# EAGLE schematic Schematico-amplificatore-audio (EAGLE 9.7.0)
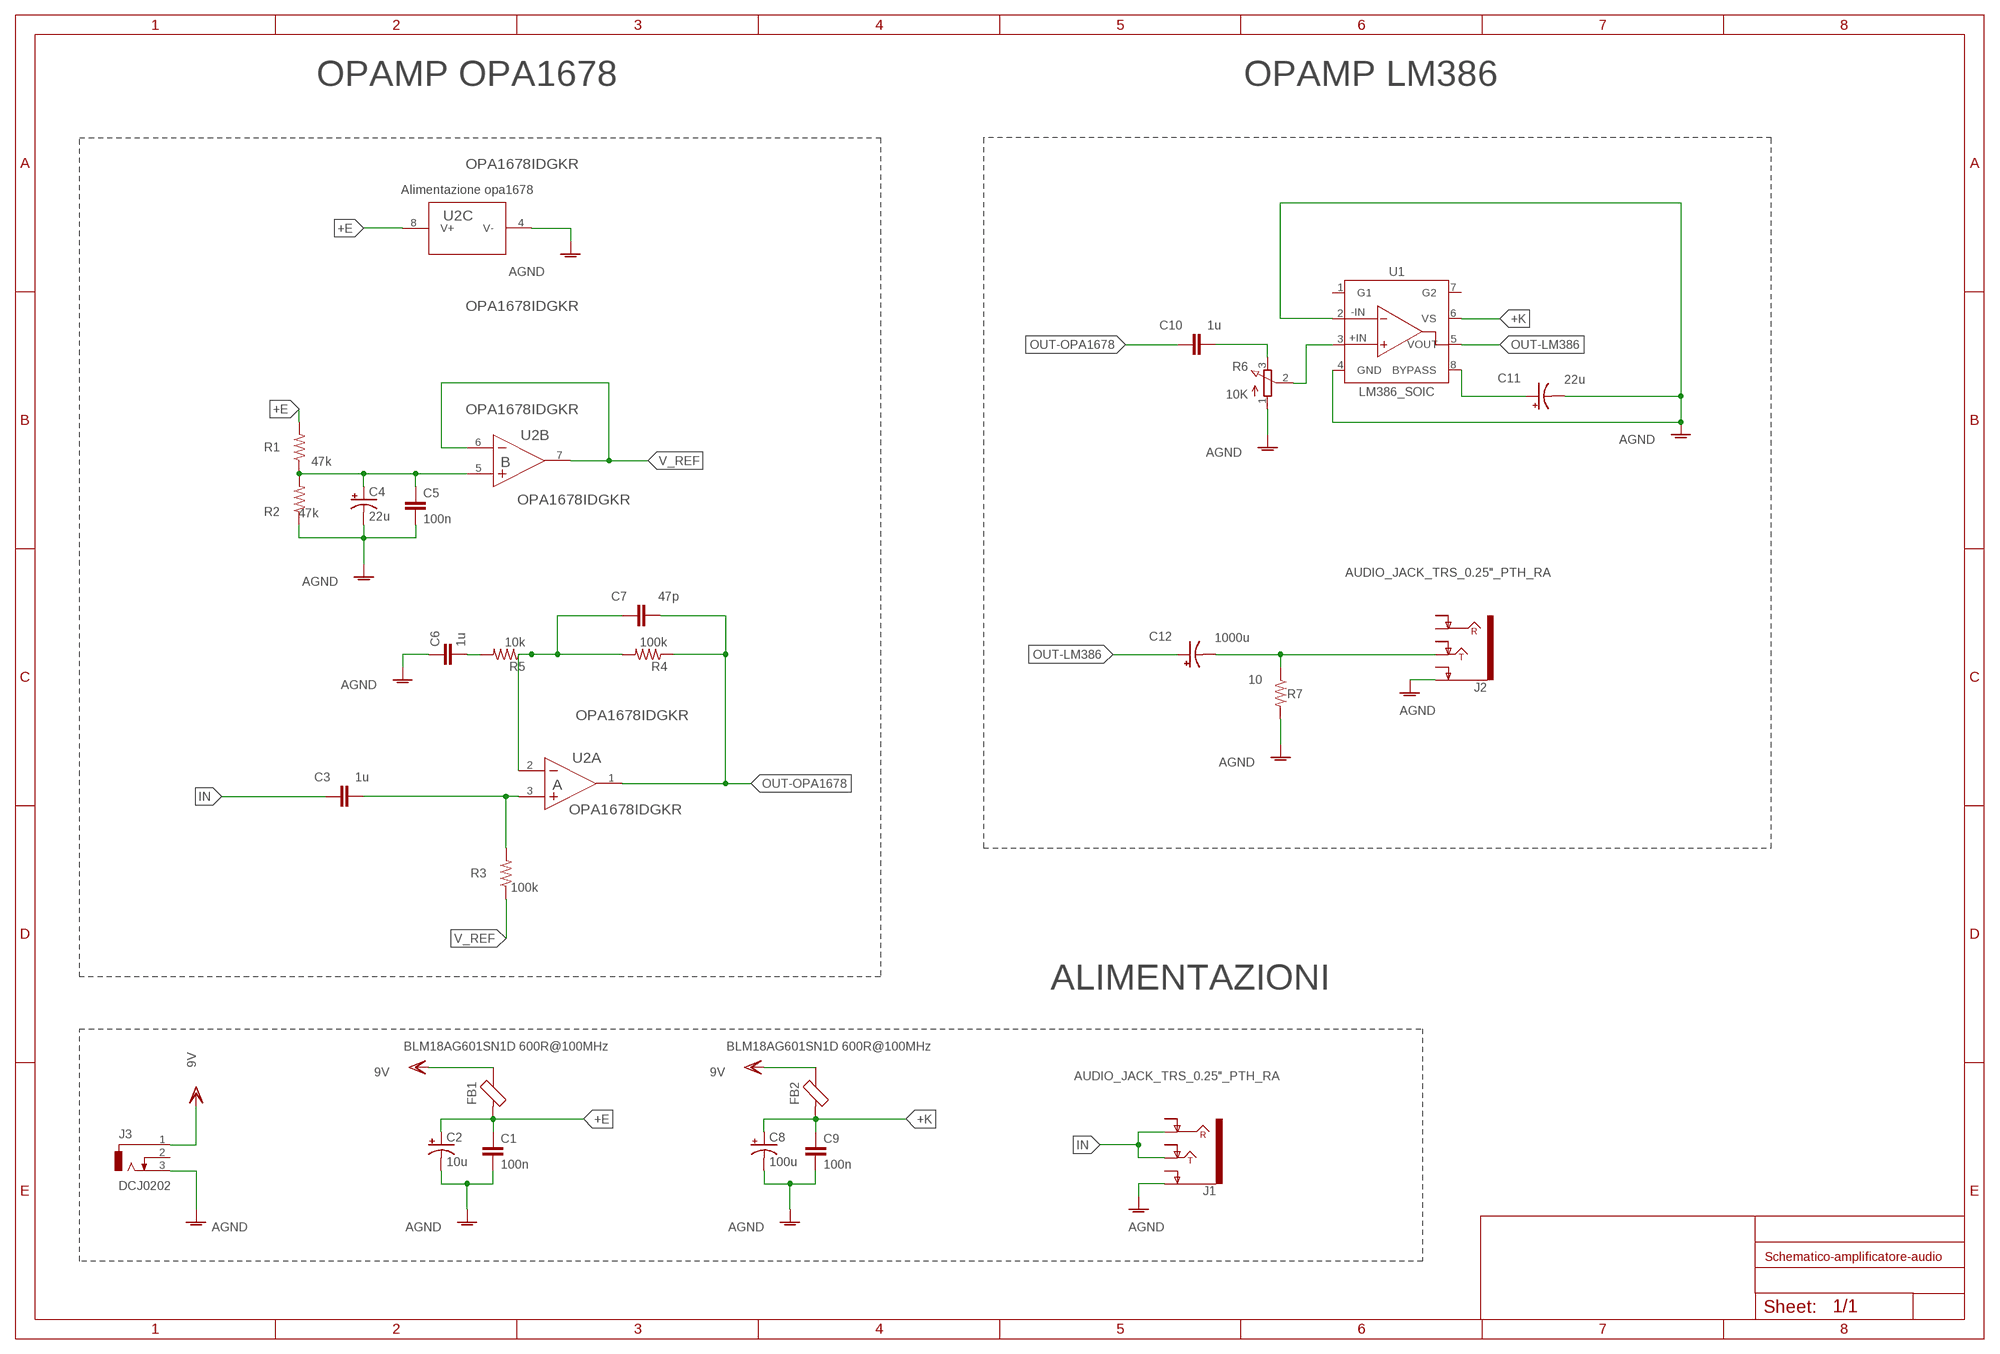
[diagram p0: schematic, sheet 1]

## Parts
C1  100n  C-EUC0603  [C0603]
C2  10u  CPOL-USCT3216  [CT3216]
C3  1u  C-EUC0603  [C0603]
C4  22u  CPOL-USCT3216  [CT3216]
C5  100n  C-EUC0603  [C0603]
C6  1u  C-EUC0603  [C0603]
C7  47p  C-EUC0603  [C0603]
C8  100u  CPOL-USCT3216  [CT3216]
C9  100n  C-EUC0603  [C0603]
C10  1u  C-EUC0603  [C0603]
C11  22u  CPOL-USCT3216  [CT3216]
C12  1000u  CPOL-USCT3216  [CT3216]
FB1  BLM18AG601SN1D 600R@100MHz  FB_BLM18AG601SN1D_0603(1608)  [BEADC1608X95N]
FB2  BLM18AG601SN1D 600R@100MHz  FB_BLM18AG601SN1D_0603(1608)  [BEADC1608X95N]
J1  AUDIO_JACK_TRS_0.25"_PTH_RA  [AUDIO_JACK_0.25"_TRS_PTH_RA]
J2  AUDIO_JACK_TRS_0.25"_PTH_RA  [AUDIO_JACK_0.25"_TRS_PTH_RA]
J3  DCJ0202  [DCJ0202]
R1  47k  R-US_R0603  [R0603]
R2  47k  R-US_R0603  [R0603]
R3  100k  R-US_R0603  [R0603]
R4  100k  R-US_R0603  [R0603]
R5  10k  R-US_R0603  [R0603]
R6  10K  3RP/1610N  [3RP/1610N]
R7  10  R-US_R0603  [R0603]
U1  LM386_SOIC  [SOIC127P600X175-8N]
U2  OPA1678IDGKR  [DGK0008A_N]

## Nets
+E: C1.1 C2.+ FB1.1 R1.2 U2.8(C:V+)
+K: C8.+ C9.1 FB2.1 U1.6(VS)
AGND: C1.2 C2.- C4.- C5.2 C6.1 C8.- C9.2 C11.- J1.SLEEVE(EARTH) J2.SLEEVE(EARTH) J3.3 R2.1 R6.1(A) R7.2 U1.2(-IN) U1.4(GND) U2.4(C:V-)
IN: C3.1 J1.RING J1.TIP
N$1: C11.+ U1.8(BYPASS)
N$2: C4.+ C5.1 R1.1 R2.2 U2.5(B:IN+)
N$3: R6.2(S) U1.3(+IN)
N$4: C3.2 R3.2 U2.3(A:IN+)
N$5: C12.- J2.TIP R7.1
N$6: C7.1 R4.2 R5.1 U2.2(A:IN-)
N$7: C6.2 R5.2
N$8: C10.2 R6.3(E)
OUT-LM386: C12.+ U1.5(VOUT)
OUT-OPA1678: C7.2 C10.1 R4.1 U2.1(A:OUT)
V_REF: R3.1 U2.6(B:IN-) U2.7(B:OUT)
VDD: FB1.2 FB2.2 J3.1 ; supply symbol labelled 9V
Unconnected: J1.RING-NORM J1.SLEEVE-NORM(EARTH-NORM) J1.TIP-NORM J2.RING J2.RING-NORM J2.SLEEVE-NORM(EARTH-NORM) J2.TIP-NORM J3.2 U1.1(G1) U1.7(G2)

## Notes on the sheet
- OPAMP OPA1678 | OPAMP LM386
- Alimentazione opa1678
- ALIMENTAZIONI

## Library data of the parts
C1 C3 C5-C7 C9 C10 = rcl:C-EU: CAPACITOR, European symbol; SPICEPREFIX: C
C2 C4 C8 C11 C12 = rcl:CPOL-US: POLARIZED CAPACITOR, American symbol; SPICEPREFIX: C
FB1 FB2 = Filter:FB_: Ferrite Bead - Popular parts; CATEGORY_L1: Ferrite Bead; CATEGORY_L2: Ferrite Chip Beads; CATEGORY_L3: NA; CURRENT_RATING: 500mA; DATASHEET: https://www.murata.com/products/productdata/8796738650142/ENFA0003.pdf; DC_RESISTANCE: 380mOhm; DESCRIPTION: 600 Ohms @ 100 MHz 1 Ferrite Bead 0603 (1608 Metric) 500mA 380mOhm; IMPEDANCE: 600Ohms; MANUFACTURER: Murata Electronics; MPN: BLM18AG601SN1D; OPERATING_TEMPERATURE: -55°C ~ 125°C; PACKAGE: Surface Mount; PACKAGE_SIZE: 0603; PART_STATUS: Active; ROHS: Compliant; SERIES: MIFIL® BLM18
J1 J2 = SparkFun-Connectors:AUDIO_JACK_TRS_0.25"_PTH_RA: Audio Jack, 1/4" TRS jack, horizontal, PTH, aka "Phono jack" Find the connector here: Audio Jack - 1/4" Stereo (right angle) <https://www.sparkfun.com/products/11144> (COM-11144) Datasheet <http://cdn.sparkfun.com/datasheets/Components/General/JP-611%20DD.jpg> Note, although the datasheet and physical part are slightly different, this footprint was proven to mate well on the Proto Pedal. This device is used on these SparkFun Products: SparkFun TRS Jack Breakout - 1/4" Stereo <https://www.sparkfun.com/products/13005> (BOB-13005 ) SparkFun Proto Pedal - sorry bad link - product comming soon! <https://www.sparkfun.com/products/13124> (PRT-13124); PROD_ID: CONN-12339; SF_ID: COM-11144
J3 = con-jack:DCJ0202: DC POWER JACK Source: DCJ0202.pdf; OC_FARNELL: unknown; OC_NEWARK: unknown
R1-R5 R7 = rcl:R-US_: RESISTOR, American symbol; SPICEPREFIX: R
R6 = pot:3RP/1610N: 16mm Potentiometer one level Source: http://www.alphapotentiometers.net/html/16mm_pot_2.html
U1 = IC_Linear:LM386: Audio Power Amplifier Reference: Datasheet <https://www.ti.com/lit/ds/symlink/lm386.pdf>; CATEGORY_L1: Linear ICs; CATEGORY_L2: Amplifiers; CATEGORY_L3: Audio; DESCRIPTION: Amplifier IC 1-Channel (Mono) Class AB 8-SOIC; PACKAGE: Surface Mount; PACKAGE_SIZE: 8-SOIC; SERIES: LM386
U2 = OPA1678.lbr:OPA1678IDGKR; COPYRIGHT: Copyright (C) 2026 Ultra Librarian. All rights reserved.; DATASHEET: https://www.ti.com/lit/gpn/opa1678; DESCRIPTION: Low distortion (-120 dB), low noise (4.5nV/rtHz), dual audio op amp 8-VSSOP -40 to 85; MANUFACTURER_NAME: Texas Instruments; MANUFACTURER_PART_NUMBER: OPA1678IDGKR; REFDES: RefDes; TYPE: TYPE